# EAGLE design cinamin (EAGLE 6.5.0)
AUTHOR: Joshua Adkins; REV: A; REVISION: A

## Sheet 1 of 4
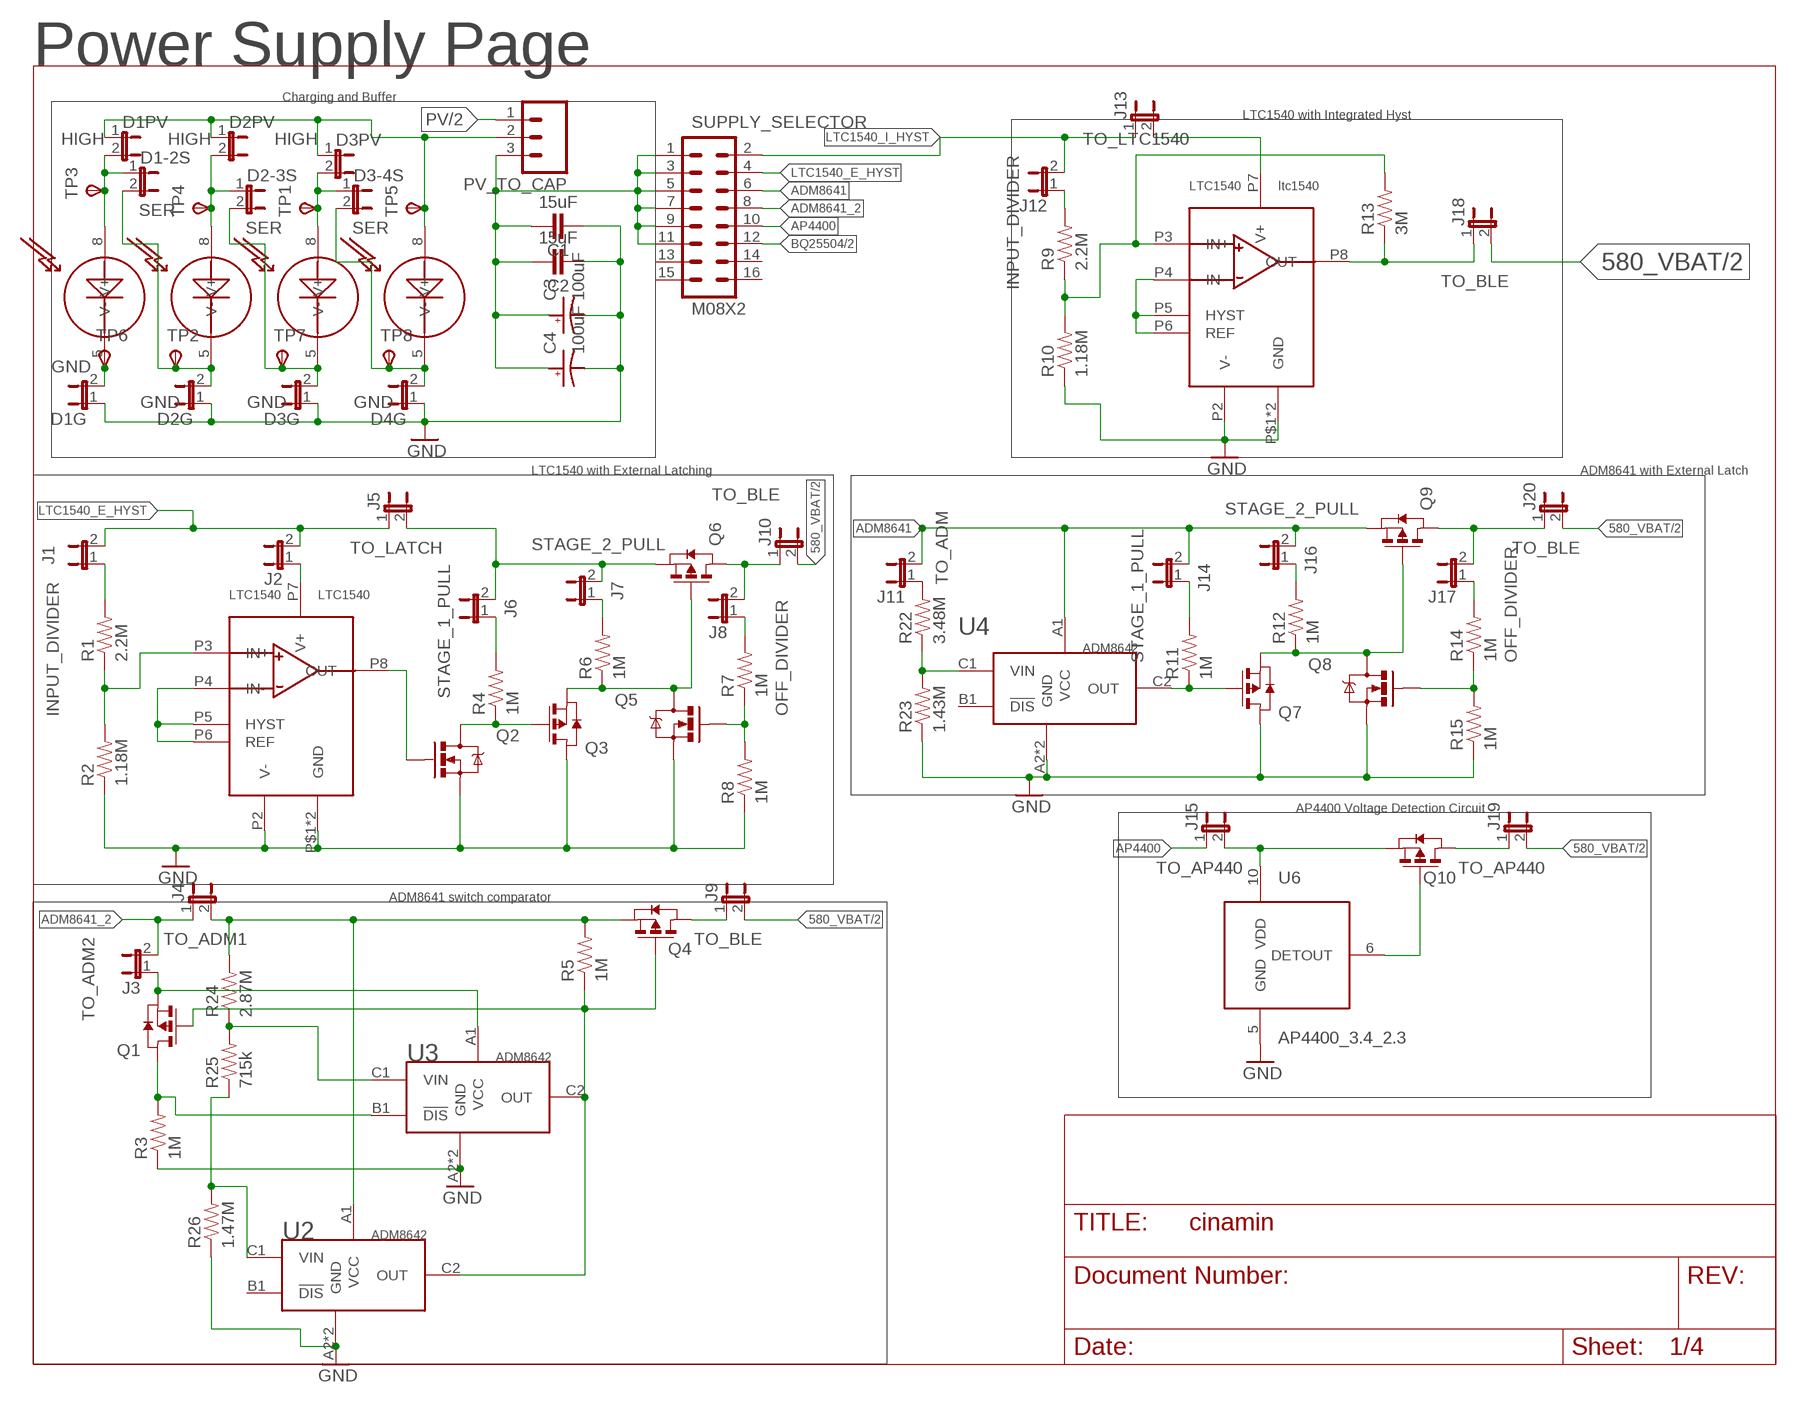
[diagram p0: schematic, sheet 1]

### Parts
C1  15uF  CAPACITOR  [0402_CAP]
C2  15uF  CAPACITOR  [0402_CAP]
C3  100uF  CAP_POL0603  [CAP0603]
C4  100uF  CAP_POL0603  [CAP0603]
D1  CPC1822  [SOIC-8]
D1-2S  SER  JUMPER-2PTH  [1X02]
D1G  GND  JUMPER-2PTH  [1X02]
D1PV  HIGH  JUMPER-2PTH  [1X02]
D2  CPC1822  [SOIC-8]
D2-3S  SER  JUMPER-2PTH  [1X02]
D2G  GND  JUMPER-2PTH  [1X02]
D2PV  HIGH  JUMPER-2PTH  [1X02]
D3  CPC1822  [SOIC-8]
D3-4S  SER  JUMPER-2PTH  [1X02]
D3G  GND  JUMPER-2PTH  [1X02]
D3PV  HIGH  JUMPER-2PTH  [1X02]
D4  CPC1822  [SOIC-8]
D4G  GND  JUMPER-2PTH  [1X02]
J1  INPUT_DIVIDER  JUMPER-2PTH  [1X02]
J2  JUMPER-2PTH  [1X02]
J3  TO_ADM2  JUMPER-2PTH  [1X02]
J4  TO_ADM1  JUMPER-2PTH  [1X02]
J5  TO_LATCH  JUMPER-2PTH  [1X02]
J6  STAGE_1_PULL  JUMPER-2PTH  [1X02]
J7  STAGE_2_PULL  JUMPER-2PTH  [1X02]
J8  OFF_DIVIDER  JUMPER-2PTH  [1X02]
J9  TO_BLE  JUMPER-2PTH  [1X02]
J10  TO_BLE  JUMPER-2PTH  [1X02]
J11  TO_ADM  JUMPER-2PTH  [1X02]
J12  INPUT_DIVIDER  JUMPER-2PTH  [1X02]
J13  TO_LTC1540  JUMPER-2PTH  [1X02]
J14  STAGE_1_PULL  JUMPER-2PTH  [1X02]
J15  TO_AP440  JUMPER-2PTH  [1X02]
J16  STAGE_2_PULL  JUMPER-2PTH  [1X02]
J17  OFF_DIVIDER  JUMPER-2PTH  [1X02]
J18  TO_BLE  JUMPER-2PTH  [1X02]
J19  TO_AP440  JUMPER-2PTH  [1X02]
J20  TO_BLE  JUMPER-2PTH  [1X02]
PV_TO_CAP  M03PTH  [1X03]
Q1  MOSFET-PCHANNEL  [XFDFN-3]
Q2  MOSFET-NCHANNELXFDN-3  [XFDFN-3]
Q3  MOSFET-PCHANNEL  [XFDFN-3]
Q4  MOSFET-PCHANNEL  [XFDFN-3]
Q5  MOSFET-NCHANNELXFDN-3  [XFDFN-3]
Q6  MOSFET-PCHANNEL  [XFDFN-3]
Q7  MOSFET-PCHANNEL  [XFDFN-3]
Q8  MOSFET-NCHANNELXFDN-3  [XFDFN-3]
Q9  MOSFET-PCHANNEL  [XFDFN-3]
Q10  MOSFET-PCHANNEL  [XFDFN-3]
R1  2.2M  RESISTOR0402_RES  [0402_RES]
R2  1.18M  RESISTOR0402_RES  [0402_RES]
R3  1M  RESISTOR0402_RES  [0402_RES]
R4  1M  RESISTOR0402_RES  [0402_RES]
R5  1M  RESISTOR0402_RES  [0402_RES]
R6  1M  RESISTOR0402_RES  [0402_RES]
R7  1M  RESISTOR0402_RES  [0402_RES]
R8  1M  RESISTOR0402_RES  [0402_RES]
R9  2.2M  RESISTOR0402_RES  [0402_RES]
R10  1.18M  RESISTOR0402_RES  [0402_RES]
R11  1M  RESISTOR0402_RES  [0402_RES]
R12  1M  RESISTOR0402_RES  [0402_RES]
R13  3M  RESISTOR0402_RES  [0402_RES]
R14  1M  RESISTOR0402_RES  [0402_RES]
R15  1M  RESISTOR0402_RES  [0402_RES]
R22  3.48M  RESISTOR0402_RES  [0402_RES]
R23  1.43M  RESISTOR0402_RES  [0402_RES]
R24  2.87M  RESISTOR0402_RES  [0402_RES]
R25  715k  RESISTOR0402_RES  [0402_RES]
R26  1.47M  RESISTOR0402_RES  [0402_RES]
SUPPLY_SELECTOR  M08X2  [2X8]
TP1  TPSPAD1-13  [P1-13]
TP2  TPSPAD1-13  [P1-13]
TP3  TPSPAD1-13  [P1-13]
TP4  TPSPAD1-13  [P1-13]
TP5  TPSPAD1-13  [P1-13]
TP6  TPSPAD1-13  [P1-13]
TP7  TPSPAD1-13  [P1-13]
TP8  TPSPAD1-13  [P1-13]
U1  LTC1540  [DFN-8]
U2  ADM8642  [WLCSP-6]
U3  ADM8642  [WLCSP-6]
U4  ADM8642  [WLCSP-6]
U5  ltc1540  LTC1540  [DFN-8]
U6  AP4400_3.4_2.3  AP4400  [TSOP-10]

### Nets
580_VBAT: J9.2 J10.2 J18.2 J19.2 J20.2 ; also sheet 2,3
ADM8641: J11.2 J14.2 J16.2 Q9.S SUPPLY_SELECTOR.6 U4.A1(VCC)
ADM8641_2: J3.2 J4.1 SUPPLY_SELECTOR.8
AP4400: J15.1 SUPPLY_SELECTOR.10
BQ25504: SUPPLY_SELECTOR.12 ; also sheet 2
GND: C1.2 C2.2 C3.NEG(ANODE) C4.NEG(ANODE) D1G.1 D2G.1 D3G.1 D4G.1 Q2.S Q3.D Q5.S Q7.D Q8.S R2.1 R3.1 R8.1 R10.1 R15.1 R23.1 R26.1 U1.P1(GND) U1.P2(V-) U1.P$1(GND) U2.A2(GND) U2.B2(GND) U3.A2(GND) U3.B2(GND) U4.A2(GND) U4.B2(GND) U5.P1(GND) U5.P2(V-) U5.P$1(GND) U6.5(GND) ; also sheet 2,3,4
HIGH: J19.1 Q10.D
LTC1540_E_HYST: J1.2 J2.2 J5.1 SUPPLY_SELECTOR.4
LTC1540_I_HYST: J12.2 J13.1 SUPPLY_SELECTOR.2
N$1: C1.1 C2.1 C3.POS(CATHODE) C4.POS(CATHODE) PV_TO_CAP.3 SUPPLY_SELECTOR.1 SUPPLY_SELECTOR.3 SUPPLY_SELECTOR.5 SUPPLY_SELECTOR.7 SUPPLY_SELECTOR.9 SUPPLY_SELECTOR.11
N$2: U1.P4(IN-) U1.P5(HYST) U1.P6(REF)
N$3: R9.1 R10.2 R13.2 U5.P3(IN+)
N$4: U5.P4(IN-) U5.P5(HYST) U5.P6(REF)
N$9: Q2.G U1.P8(OUT)
N$13: J11.1 R22.2
N$14: R1.1 R2.2 U1.P3(IN+)
N$15: Q2.D Q3.G R4.1
N$18: J1.1 R1.2
N$19: Q3.S Q5.D Q6.G R6.1
N$20: J2.1 U1.P7(V+)
N$21: J6.1 R4.2
N$22: J7.1 R6.2
N$23: Q5.G R7.1 R8.2
N$24: J8.2 J10.1 Q6.D
N$25: J5.2 J6.2 J7.2 Q6.S
N$26: J8.1 R7.2
N$27: J12.1 R9.2
N$28: J13.2 U5.P7(V+)
N$29: Q7.G R11.1 U4.C2(OUT)
N$30: Q7.S Q8.D Q9.G R12.1
N$31: Q8.G R14.1 R15.2
N$32: J17.2 J20.1 Q9.D
N$33: J14.1 R11.2
N$34: J16.1 R12.2
N$35: R24.1 R25.2 U3.C1(VIN)
N$36: J17.1 R14.2
N$37: Q10.G U6.6(DETOUT)
N$38: J9.1 Q4.D
N$39: Q1.D R3.2 U3.B1(!DIS)
N$40: J3.1 Q1.S U3.A1(VCC)
N$41: Q1.G Q4.G R5.1 U2.C2(OUT) U3.C2(OUT)
N$42: J4.2 Q4.S R5.2 R24.2 U2.A1(VCC)
N$43: D3-4S.2 D4.5(V-) D4G.2 TP8.TP(PP)
N$59: R22.1 R23.2 U4.C1(VIN)
N$60: R25.1 R26.2 U2.C1(VIN)
N$61: D1.5(V-) D1G.2 TP6.TP(PP)
N$62: D1-2S.2 D2.5(V-) D2G.2 TP2.TP(PP)
N$63: D2-3S.2 D3.5(V-) D3G.2 TP7.TP(PP)
N$65: D1-2S.1 D1.8(V+) D1PV.2 TP3.TP(PP)
N$66: D1PV.1 D2PV.1 D3PV.1 D4.8(V+) PV_TO_CAP.2 TP5.TP(PP)
N$67: D2-3S.1 D2.8(V+) D2PV.2 TP4.TP(PP)
N$68: D3-4S.1 D3.8(V+) D3PV.2 TP1.TP(PP)
OUT: J18.1 R13.1 U5.P8(OUT)
PV: PV_TO_CAP.1 ; also sheet 2
VDD: J15.2 Q10.S U6.10(VDD)
Unconnected: SUPPLY_SELECTOR.13 SUPPLY_SELECTOR.14 SUPPLY_SELECTOR.15 SUPPLY_SELECTOR.16 U2.B1(!DIS) U4.B1(!DIS)

### Notes on the sheet
- Power Supply Page
- Charging and Buffer
- LTC1540 with Integrated Hyst
- LTC1540 with External Latching | ADM8641 with External Latch
- AP4400 Voltage Detection Circuit
- ADM8641 switch comparator

## Sheet 2 of 4
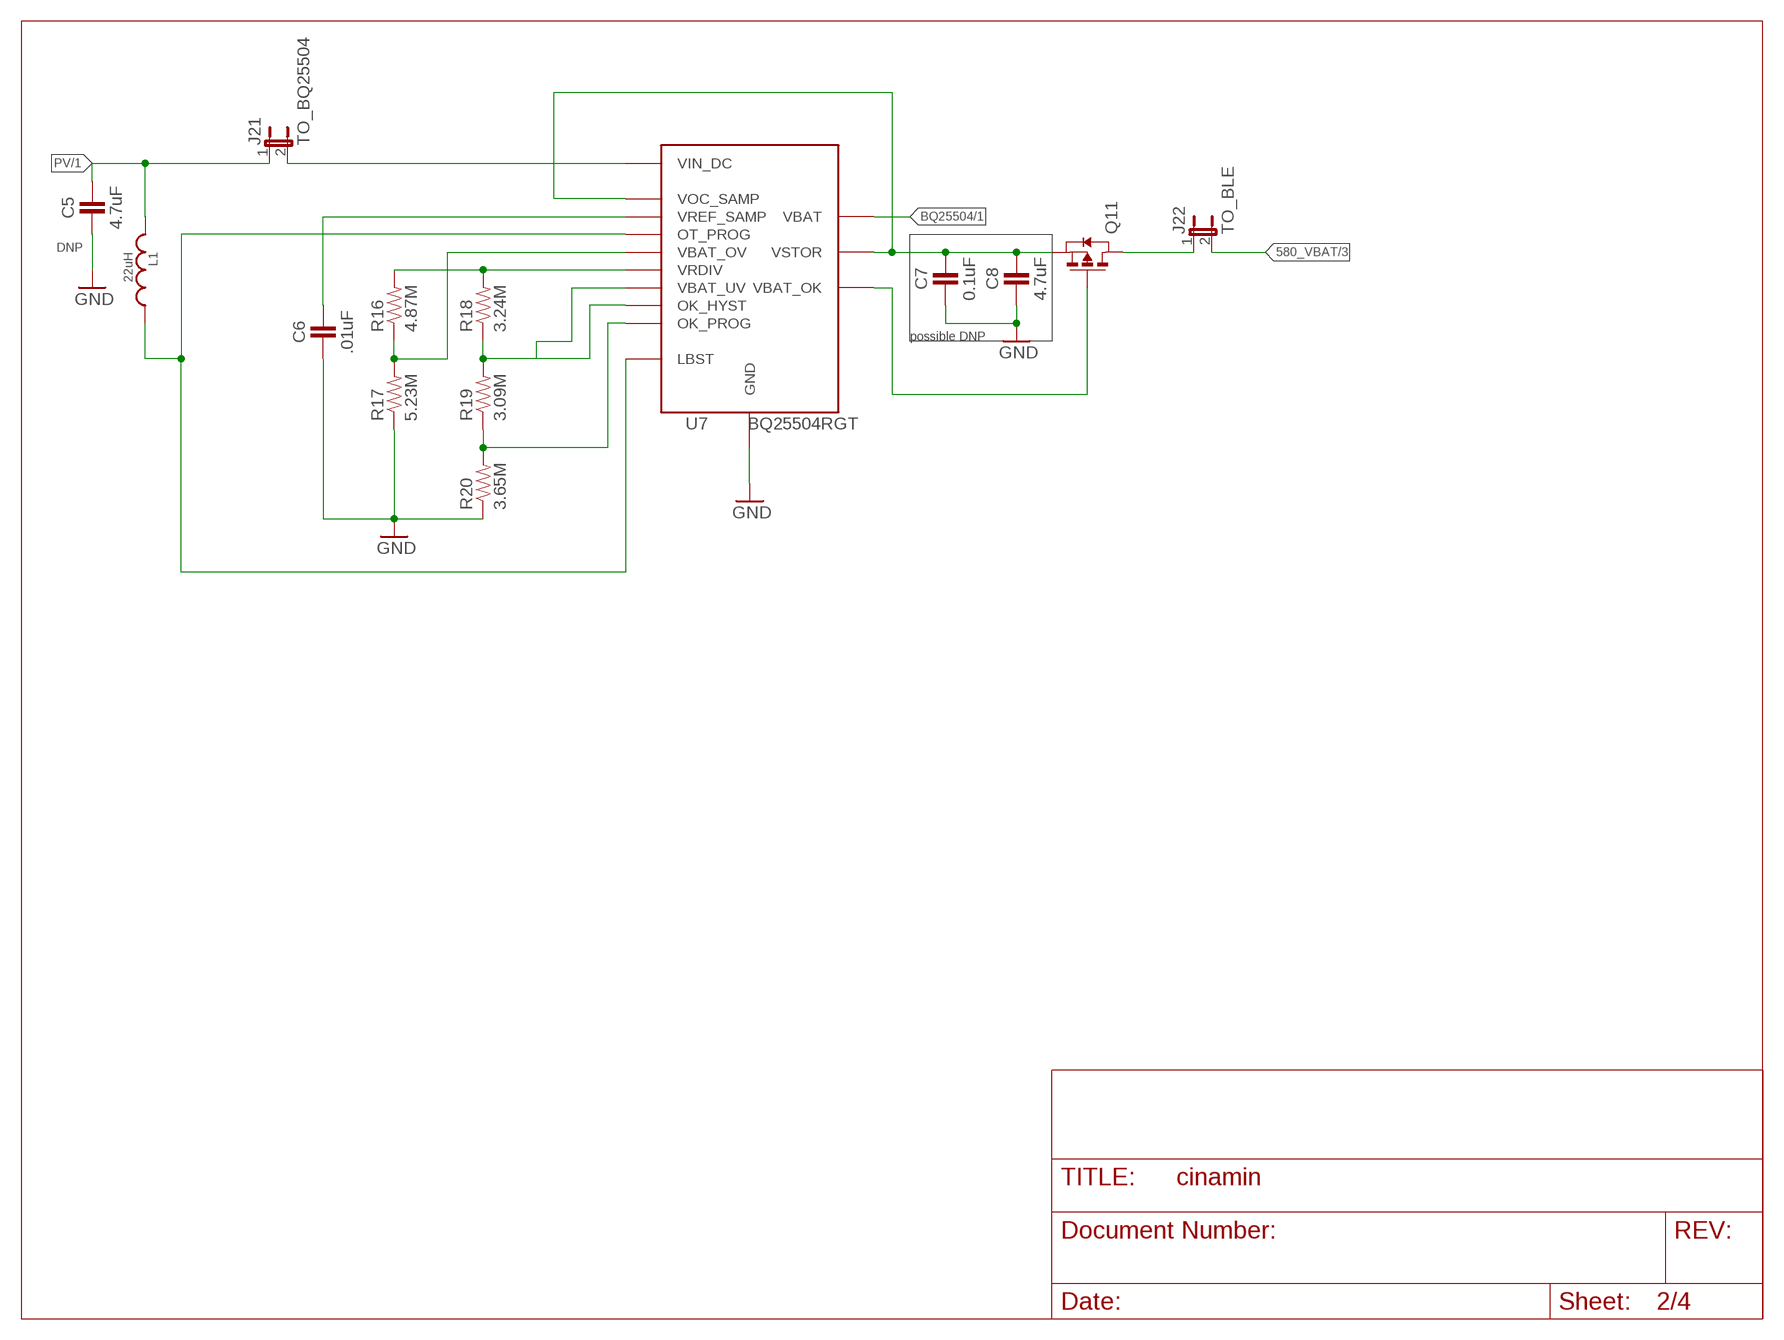
[diagram p1: schematic, sheet 2]

### Parts
C5  4.7uF  CAPACITOR  [0402_CAP]
C6  .01uF  CAPACITOR  [0402_CAP]
C7  0.1uF  CAPACITOR  [0402_CAP]
C8  4.7uF  CAPACITOR  [0402_CAP]
J21  TO_BQ25504  JUMPER-2PTH  [1X02]
J22  TO_BLE  JUMPER-2PTH  [1X02]
L1  22uH  INDUCTOR0603  [0603_CAP]
Q11  MOSFET-PCHANNEL  [XFDFN-3]
R16  4.87M  RESISTOR0402_RES  [0402_RES]
R17  5.23M  RESISTOR0402_RES  [0402_RES]
R18  3.24M  RESISTOR0402_RES  [0402_RES]
R19  3.09M  RESISTOR0402_RES  [0402_RES]
R20  3.65M  RESISTOR0402_RES  [0402_RES]
U7  BQ25504RGT  [S-PVQFN-N16]

### Nets
580_VBAT: J22.2 ; also sheet 1,3
BQ25504: U7.14(VBAT) ; also sheet 1
GND: C5.2 C6.2 C7.2 C8.2 R17.1 R20.1 U7.1(GND) U7.12(GND) U7.13(GND) ; also sheet 1,3,4
N$44: L1.1 U7.5(OT_PROG) U7.16(LBST)
N$45: U7.8(VBAT_UV)
N$46: R16.2 R18.2 U7.7(VRDIV)
N$47: Q11.G U7.11(VBAT_OK)
N$49: R18.1 R19.2 U7.9(OK_HYST)
N$50: R19.1 R20.2 U7.10(OK_PROG)
N$51: C6.1 U7.4(VREF_SAMP)
N$54: R16.1 R17.2 U7.6(VBAT_OV)
OUT2: J22.1 Q11.D
PV: C5.1 J21.1 L1.2 ; also sheet 1
VIN_DC: J21.2 U7.2(VIN_DC)
VSTOR: C7.1 C8.1 Q11.S U7.3(VOC_SAMP) U7.15(VSTOR)

### Notes on the sheet
- DNP
- possible DNP

## Sheet 3 of 4
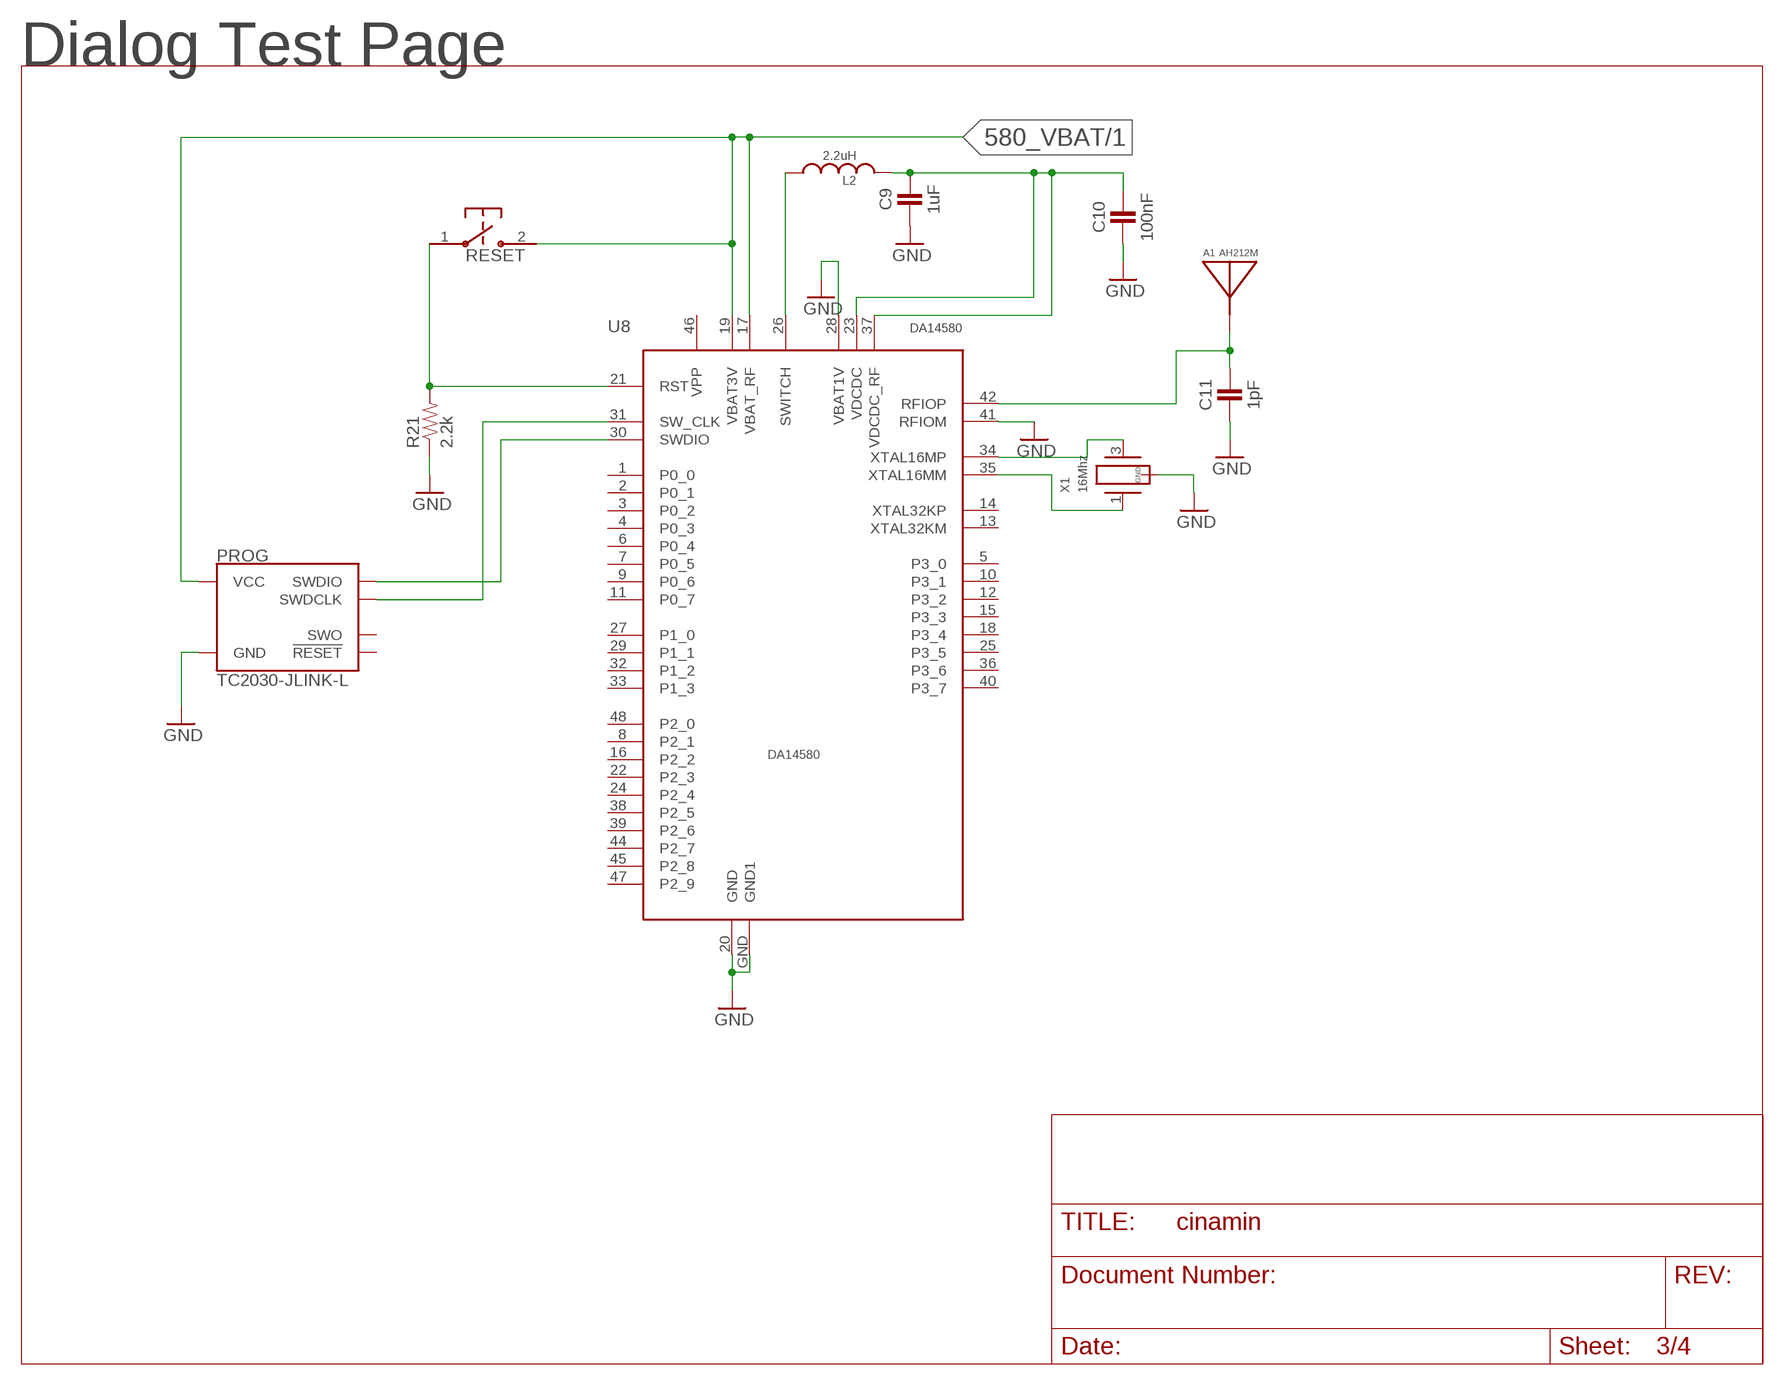
[diagram p2: schematic, sheet 3]

### Parts
A1  AH212M  [AH212M]
C9  1uF  CAPACITOR  [0402_CAP]
C10  100nF  CAPACITOR  [0402_CAP]
C11  1pF  CAPACITOR  [0402_CAP]
L2  2.2uH  INDUCTOR0402  [0402_CAP]
PROG  TC2030-JLINK-L  [TC2030-IDC]
R21  2.2k  RESISTOR0402_RES  [0402_RES]
RESET  B3U-1000P  [B3U-1000P]
U8  DA14580  DA14580-48  [QFN-48-6MM]
X1  16Mhz  TXC-8Y  [TXC-8Y]

### Nets
580_VBAT: PROG.1(VCC) RESET.2 U8.17(VBAT_RF) U8.19(VBAT3V) ; also sheet 1,2
GND: C9.2 C10.2 C11.2 PROG.5(GND) R21.1 U8.20(GND) U8.28(VBAT1V) U8.41(RFIOM) U8.GND(GND1) X1.2(GND) X1.4(GND) ; also sheet 1,2,4
N$5: A1.P1(ANTENNA) C11.1 U8.42(RFIOP)
N$7: L2.1 U8.26(SWITCH)
N$8: C9.1 C10.1 L2.2 U8.23(VDCDC) U8.37(VDCDC_RF)
N$10: U8.34(XTAL16MP) X1.3
N$11: U8.35(XTAL16MM) X1.1
N$52: PROG.2(SWDIO) U8.30(SWDIO)
N$53: PROG.4(SWDCLK) U8.31(SW_CLK)
N$56: R21.2 RESET.1 U8.21(RST)
Unconnected: PROG.3(!RESET) PROG.6(SWO) U8.1(P0_0) U8.2(P0_1) U8.3(P0_2) U8.4(P0_3) U8.5(P3_0) U8.6(P0_4) U8.7(P0_5) U8.8(P2_1) U8.9(P0_6) U8.10(P3_1) U8.11(P0_7) U8.12(P3_2) U8.13(XTAL32KM) U8.14(XTAL32KP) U8.15(P3_3) U8.16(P2_2) U8.18(P3_4) U8.22(P2_3) U8.24(P2_4) U8.25(P3_5) U8.27(P1_0) U8.29(P1_1) U8.32(P1_2) U8.33(P1_3) U8.36(P3_6) U8.38(P2_5) U8.39(P2_6) U8.40(P3_7) U8.44(P2_7) U8.45(P2_8) U8.46(VPP) U8.47(P2_9) U8.48(P2_0)

### Notes on the sheet
- Dialog Test Page

## Sheet 4 of 4
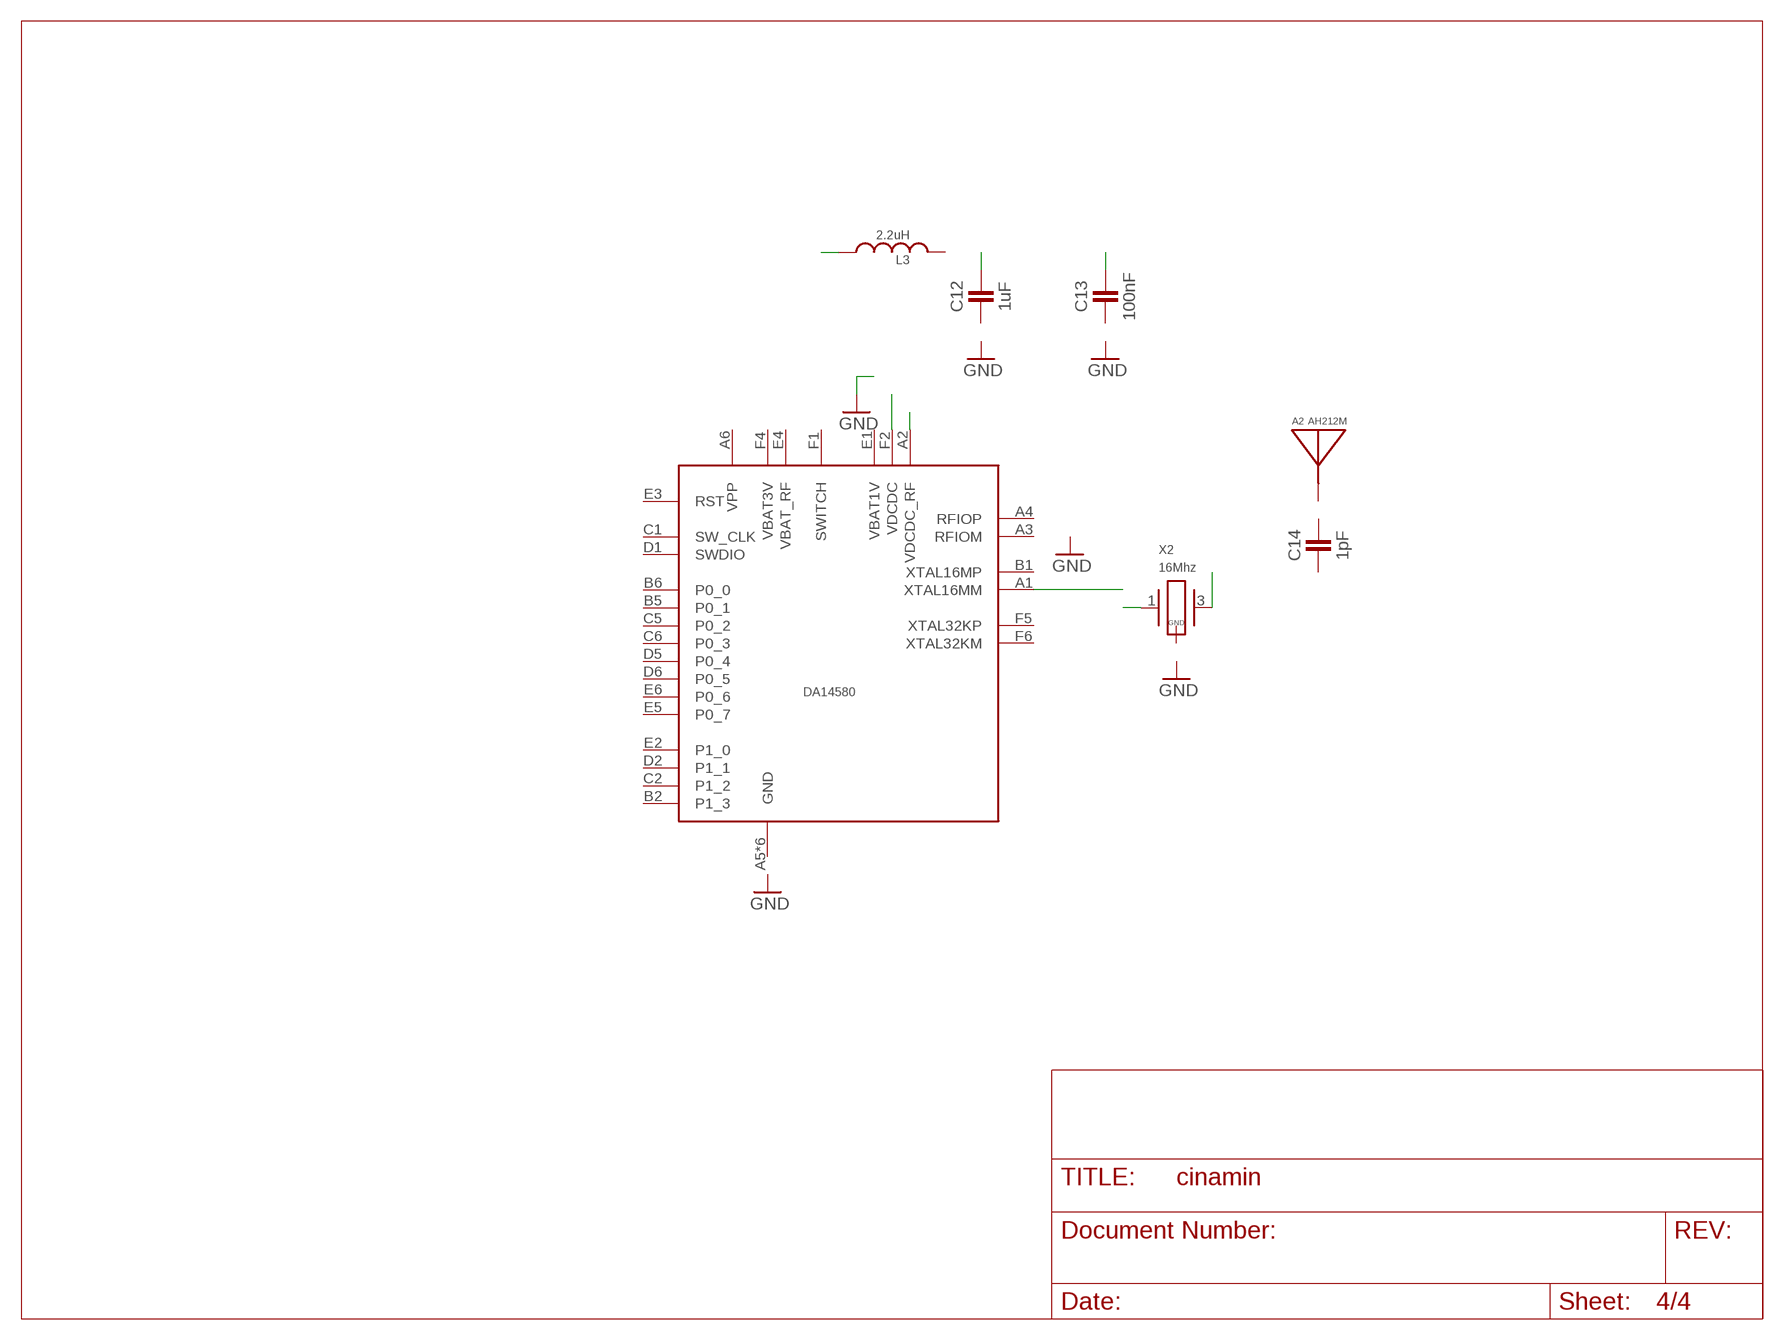
[diagram p3: schematic, sheet 4]

### Parts
A2  AH212M  AF212M  [AH212M@1]
C12  1uF  CAPACITOR01005_CAP  [01005_CAP]
C13  100nF  CAPACITOR01005_CAP  [01005_CAP]
C14  1pF  CAPACITOR0201_CAP  [0201_CAP]
L3  2.2uH  INDUCTOR0402  [0402_CAP]
U9  DA14580-BGA  [WLCSP34]
X2  16Mhz  TXC-8Y  [TXC-8Y]

### Nets
N$6: U9.A2(VDCDC_RF)
N$12: L3.1
N$16: X2.3
N$17: U9.A1(XTAL16MM)
N$48: X2.1
N$55: U9.F2(VDCDC)
N$57: C12.P$1
N$58: C13.P$1
Unconnected: A2.P1(ANTENNA) C12.P$2 C13.P$2 C14.P$1 C14.P$2 L3.2 U9.A3(RFIOM) U9.A4(RFIOP) U9.A5(GND) U9.A6(VPP) U9.B1(XTAL16MP) U9.B2(P1_3) U9.B4(GND) U9.B5(P0_1) U9.B6(P0_0) U9.C1(SW_CLK) U9.C2(P1_2) U9.C3(GND) U9.C5(P0_2) U9.C6(P0_3) U9.D1(SWDIO) U9.D2(P1_1) U9.D3(GND) U9.D4(GND) U9.D5(P0_4) U9.D6(P0_5) U9.E1(VBAT1V) U9.E2(P1_0) U9.E3(RST) U9.E4(VBAT_RF) U9.E5(P0_7) U9.E6(P0_6) U9.F1(SWITCH) U9.F3(GND) U9.F4(VBAT3V) U9.F5(XTAL32KP) U9.F6(XTAL32KM) X2.2(GND) X2.4(GND)

## Library data of the parts
A1 = chips:AH212M: Small 2.4Ghz chip antenna; DIGIKEY: 587-2725-1-ND
A2 = chips:AF212M
C1 C2 C5-C14 = passives:CAPACITOR: 0402 Capacitor
C3 C4 = passives:CAP_POL
D1-D4 = chips:CPC1822: SOIC Solar Cell; DIGIKEY: CLA289-ND
D1-2S D1G D1PV D2-3S D2G D2PV D3-4S D3G D3PV D4G J1-J22 = SparkFun-Passives:JUMPER-2: Jumper Basic 0.1" spaced jumper. Use with breakaway headers.
L1-L3 = passives:INDUCTOR
PROG = connector:TC2030-JLINK
PV_TO_CAP = SparkFun-Connectors:M03: Header 3 Standard 3-pin 0.1" header. Use with straight break away headers (SKU : PRT-00116), right angle break away headers (PRT-00553), swiss pins (PRT-00743), machine pins (PRT-00117), and female headers (PRT-00115). Molex polarized connector foot print use with SKU : PRT-08232 with associated crimp pins and housings.
Q1 Q3 Q4 Q6 Q7 Q9-Q11 = fets:MOSFET-PCHANNEL: small package Pchannel fet; DIGIKEY: DMP21D5UFB4-7BDICT-ND
Q2 Q5 Q8 = fets:MOSFET-NCHANNEL: Generic NMOS footprint; DIGIKEY: DMN2400UFB4-7DICT-ND
R1-R26 = passives:RESISTOR: Resistor Basic schematic elements and footprints for 0603, 1206, and PTH resistors.
RESET = switches:B3U: Switch; DIGIKEY: SW1020CT-ND
SUPPLY_SELECTOR = SparkFun-Connectors:M08X2: .1" headers, two rows of 8 each
TP1-TP8 = testpad:TPS: TEST PIN
U1 U5 = chips:LTC1540: LTC Nanopower Comparator with Bandgap reference; DIGIKEY: LTC1540CDD#PBF-ND
U2-U4 = chips:ADM8642: analog devices comparator with separate supply; DIGIKEY: ADM8642T100ACBZ-R7CT-ND
U6 = chips:AP4400: Ultra Low Power Voltage Detector with Hysterisis; DIGIKEY: CANT_BUY
U7 = chips:BQ25504: TI BQ25504 Ultra Low Power Boost Converter with Battery Management for Energy Harvester Applications; DIGIKEY: 296-29741-1-ND
U8 = chips:DA14580-48: Dialog Semiconductor BLE chip; DIGIKEY: 1564-1014-1-ND
U9 = chips:DA14580-BGA: WLCSP package of low power BLE chip; DIGIKEY: 1564-1012-1-ND
X1 X2 = crystals:TXC-8Y: 2mmx1.6mm SMD Crystal

## Board
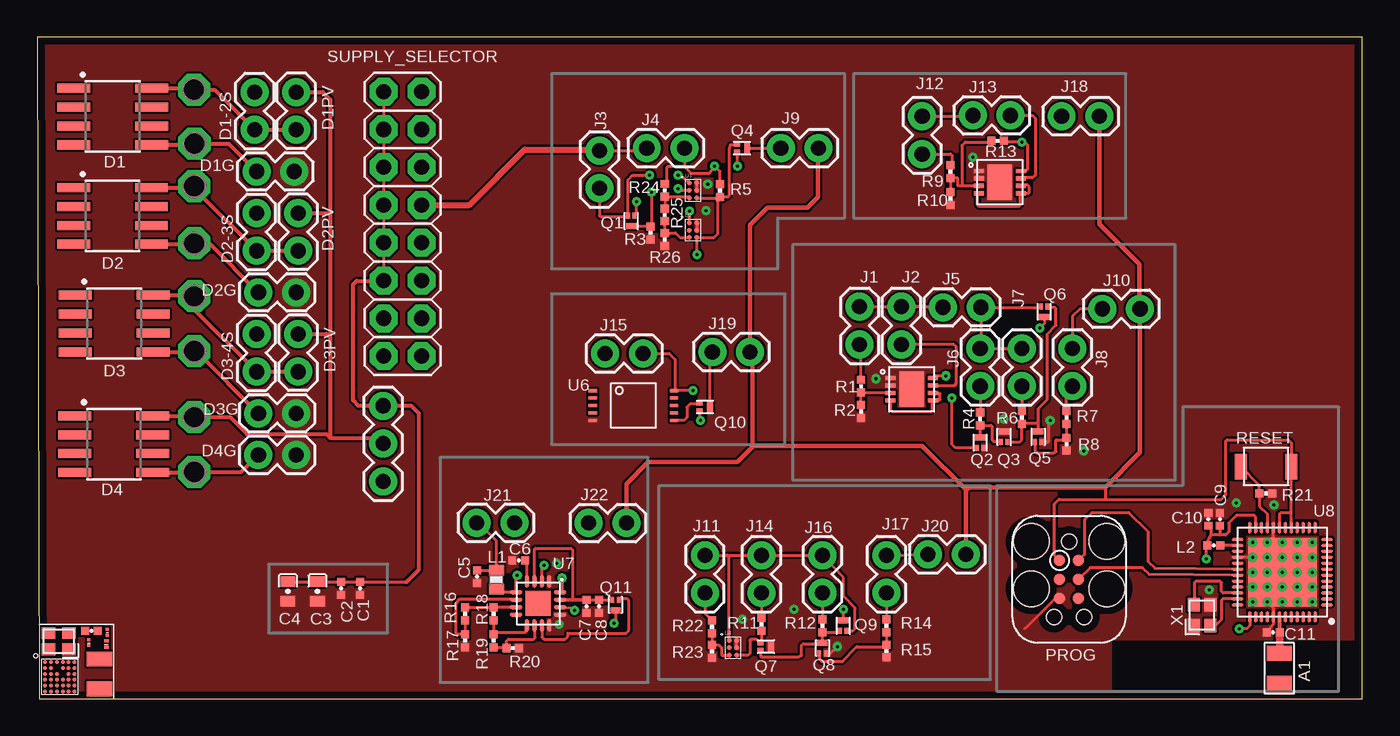
[diagram p4: board, top side]
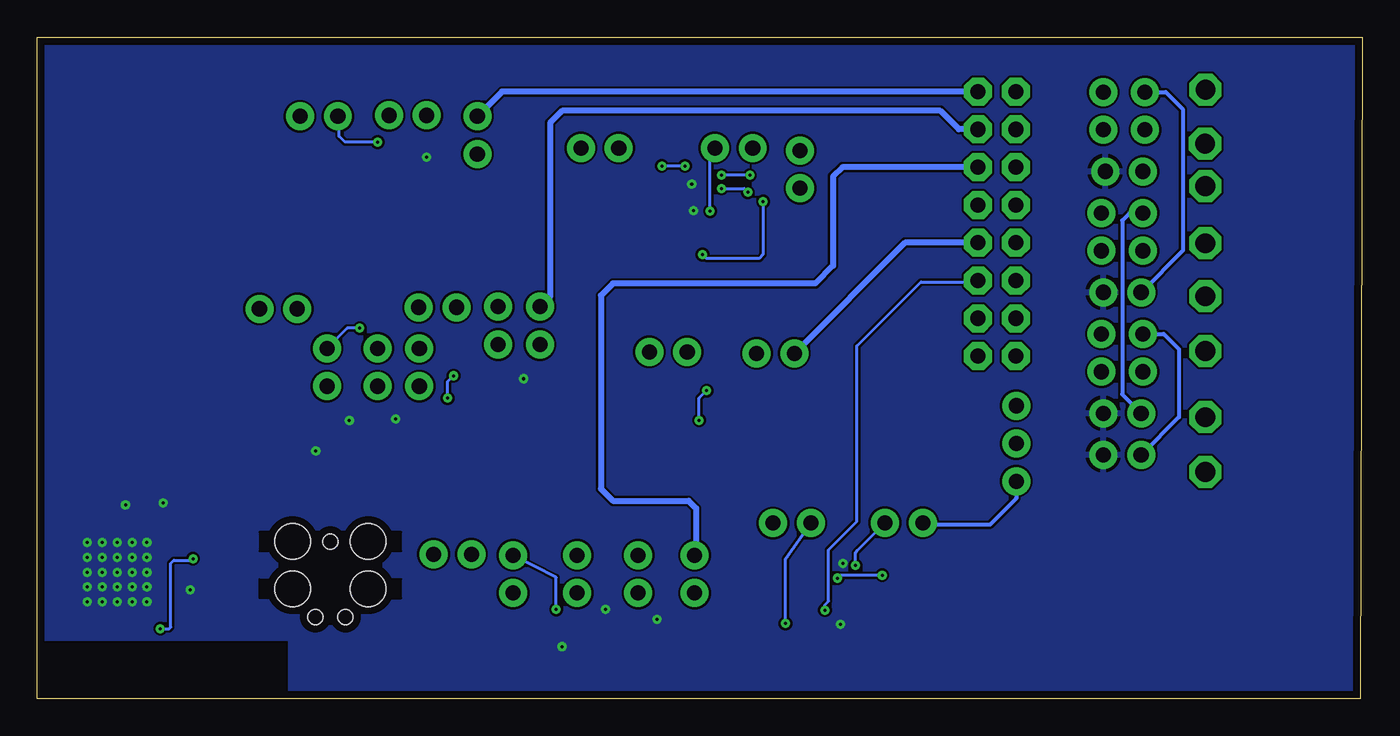
[diagram p5: board, bottom side, seen from below]

Size 89.02 x 44.45 mm. Coordinates in mm from the lower left corner, seen from the top.
Outline: 0.13,0 89.02,0 89.02,44.45 0,44.45 0.13,0
Copper layers (1*16): Top 0.0178mm / dielectric 59mil / Bottom 0.0178mm
Design rules "sunstone-2lyr_v1.0.0.3 *": minimum track width 6mil, minimum drill 14mil, track to track 6mil, track to pad 6mil, pad to pad 6mil, via to via 6mil, smd to smd 6mil, copper to edge 20mil, drill to drill 16mil, minimum pad ring 8mil, minimum via ring 8mil, stop-mask expansion 3mil, vias tented up to drill 15mil, thermal gap 10mil

### Footprints (pad centres in the part's own frame; a part is rotated, then mirrored left to right if it is on the bottom)
AH212M = smd 1.7 x 1: P1 0,0; P2 0,2
AH212M@1 = smd 1.7 x 1: P1 0,0; P2 0,2
0402_CAP = smd 0.536 x 0.546: 1 -0.433,0; 2 0.433,0
CAP0603 = smd 0.7 x 1: NEG 0.65,0; POS -0.65,0
01005_CAP = smd 0.22 x 0.2: P$1 0,0.19; P$2 0,-0.19
0201_CAP = smd 0.3 x 0.21: P$1 0,0.22; P$2 0,-0.22
SOIC-8 = smd 0.61 x 2.21: 1 -1.905,-2.616; 2 -0.635,-2.616; 3 0.635,-2.616; 4 1.905,-2.616; 5 1.905,2.616; 6 0.635,2.616; 7 -0.635,2.616; 8 -1.905,2.616
1X02 = drill 1.016 pad 1.88: 1 0,0; 2 2.54,0
0603_CAP = smd 0.7 x 1: 1 -0.65,0; 2 0.65,0
TC2030-IDC = smd 0.787 x 0.787: 1 -1.27,-0.635; 2 -1.27,0.635; 3 0,-0.635; 4 0,0.635; 5 1.27,-0.635; 6 1.27,0.635 | hole 2.375: -2.54,2.54; 0.635,2.54; 0.635,-2.54; -2.54,-2.54 | hole 1.016: -2.54,0; 2.54,1.016; 2.54,-1.016
1X03 = drill 1.016 pad 1.88: 1 0,0; 2 2.54,0; 3 5.08,0
XFDFN-3 = smd 0.4 x 0.7: D 0.35,0 | smd 0.4 x 0.25: G -0.35,0.215; S -0.35,-0.215
0402_RES = smd 0.536 x 0.546: 1 -0.433,0; 2 0.433,0
B3U-1000P = smd 0.8 x 1.7: 1 -1.7,0; 2 1.7,0
2X8 = drill 1.016 pad 1.88 octagon: 1 0,0; 2 0,2.54; 3 2.54,0; 4 2.54,2.54; 5 5.08,0; 6 5.08,2.54; 7 7.62,0; 8 7.62,2.54; 9 10.16,0; 10 10.16,2.54; 11 12.7,0; 12 12.7,2.54; 13 15.24,0; 14 15.24,2.54; 15 17.78,0; 16 17.78,2.54
P1-13 = drill 1.321 pad 2.159 octagon: TP 0,0
DFN-8 = smd 0.28 x 0.675: P1 0.75,0.08; P2 1.25,0.08; P3 1.75,0.08; P4 2.25,0.08; P5 2.25,2.92; P6 1.75,2.92; P7 1.25,2.92; P8 0.75,2.92 | smd 2.38 x 1.65: P$1 1.5,1.5
WLCSP-6 = smd 0.32 x 0.32: A1 0,1; A2 0.5,1; B1 0,0.5; B2 0.5,0.5; C1 0,0; C2 0.5,0
TSOP-10 = smd 0.22 x 0.55: 1 -1,-2.73; 2 -0.5,-2.73; 3 0,-2.73; 4 0.5,-2.73; 5 1,-2.73; 6 1,2.73; 7 0.5,2.73; 8 0,2.73; 9 -0.5,2.73; 10 -1,2.73
S-PVQFN-N16 = smd 0.85 x 0.28: 1 -1.475,0.75; 2 -1.475,0.25; 3 -1.475,-0.25; 4 -1.475,-0.75; 9 1.475,-0.75; 10 1.475,-0.25; 11 1.475,0.25; 12 1.475,0.75 | smd 0.28 x 0.85: 5 -0.75,-1.475; 6 -0.25,-1.475; 7 0.25,-1.475; 8 0.75,-1.475; 13 0.75,1.475; 14 0.25,1.475; 15 -0.25,1.475; 16 -0.75,1.475 | smd 1.7 x 1.7: THERMALPAD 0,0
QFN-48-6MM = smd 0.8 x 0.203: 1 -3,2.2; 2 -3,1.8; 3 -3,1.4; 4 -3,1; 5 -3,0.6; 6 -3,0.2; 7 -3,-0.2; 8 -3,-0.6; 9 -3,-1; 10 -3,-1.4; 11 -3,-1.8; 12 -3,-2.2; 25 3,-2.2; 26 3,-1.8; 27 3,-1.4; 28 3,-1; 29 3,-0.6; 30 3,-0.2; 31 3,0.2; 32 3,0.6; 33 3,1; 34 3,1.4; 35 3,1.8; 36 3,2.2 | smd 0.203 x 0.8: 13 -2.2,-3; 14 -1.8,-3; 15 -1.4,-3; 16 -1,-3; 17 -0.6,-3; 18 -0.2,-3; 19 0.2,-3; 20 0.6,-3; 21 1,-3; 22 1.4,-3; 23 1.8,-3; 24 2.2,-3; 37 2.2,3; 38 1.8,3; 39 1.4,3; 40 1,3; 41 0.6,3; 42 0.2,3; 43 -0.2,3; 44 -0.6,3; 45 -1,3; 46 -1.4,3; 47 -1.8,3; 48 -2.2,3 | smd 4.6 x 4.6: GND 0,0
WLCSP34 = smd 0.27 x 0.27: A1 0,2; A2 0.4,2; A3 0.8,2; A4 1.2,2; A5 1.6,2; A6 2,2; B1 0,1.6; B2 0.4,1.6; B4 1.2,1.6; B5 1.6,1.6; B6 2,1.6; C1 0,1.2; C2 0.4,1.2; C3 0.8,1.2; C5 1.6,1.2; C6 2,1.2; D1 0,0.8; D2 0.4,0.8; D3 0.8,0.8; D4 1.2,0.8; D5 1.6,0.8; D6 2,0.8; E1 0,0.4; E2 0.4,0.4; E3 0.8,0.4; E4 1.2,0.4; E5 1.6,0.4; E6 2,0.4; F1 0,0; F2 0.4,0; F3 0.8,0; F4 1.2,0; F5 1.6,0; F6 2,0
TXC-8Y = smd 0.9 x 0.8: 1 -0.7,-0.55; 2 0.7,-0.55; 3 0.7,0.55; 4 -0.7,0.55

### Placement (x,y rotation side)
A1  83.45,3.05 180 top
A2  4.19,0.66 0 top
C1  21.7,7.42 270 top
C2  20.41,7.42 270 top
C3  18.83,7.22 270 top
C4  16.84,7.22 270 top
C5  29.55,8.2 270 top
C6  32.35,9.3 180 top
C7  36.9,6.2 270 top
C8  37.75,6.2 270 top
C9  79.46,12.06 90 top
C10  78.67,12.06 90 top
C11  83.03,4.46 180 top
C12  3.47,3.76 0 top
C13  4.71,4.46 0 top
C14  4.65,3.66 0 top
D1  5.07,39.12 270 top
D1-2S  14.61,38.23 90 top
D1G  17.27,35.43 180 top
D1PV  17.4,40.77 270 top
D2  5.06,32.44 270 top
D2-3S  14.73,30.1 90 top
D2G  17.4,27.3 180 top
D2PV  17.53,32.64 270 top
D3  5.17,25.21 270 top
D3-4S  14.73,21.97 90 top
D3G  17.4,19.18 180 top
D3PV  17.53,24.51 270 top
D4  5.15,17.1 270 top
D4G  17.4,16.38 180 top
J1  55.25,23.8 90 top
J2  58.05,23.8 90 top
J3  37.77,34.3 90 top
J4  40.95,37 0 top
J5  60.85,26.3 0 top
J6  63.35,21 90 top
J7  66.15,21 90 top
J8  69.55,21 90 top
J9  49.95,37 0 top
J10  71.55,26.2 0 top
J11  44.85,7.1 90 top
J12  59.45,36.6 90 top
J13  62.85,39.2 0 top
J14  48.65,7.1 90 top
J15  38.15,23.2 0 top
J16  52.75,7.1 90 top
J17  57.05,7.1 90 top
J18  68.82,39.14 0 top
J19  45.35,23.3 0 top
J20  59.85,9.7 0 top
J21  29.53,11.82 0 top
J22  37.05,11.8 0 top
L1  30.85,8 90 top
L2  79.04,10.3 180 top
L3  3.65,4.55 180 top
PROG  69.32,8.02 270 top
PV_TO_CAP  23.24,14.61 90 top
Q1  39.9,32.1 270 top
Q2  63.35,17.2 90 top
Q3  64.95,17.6 90 top
Q4  47.35,37 0 top
Q5  67.25,17.6 90 top
Q6  67.65,26 270 top
Q7  48.95,3.5 0 top
Q8  52.75,3.4 90 top
Q9  54.15,4.9 90 top
Q10  44.85,19.6 0 top
Q11  38.85,6.3 270 top
R1  55.35,21 90 top
R2  55.35,19.3 90 top
R3  41.2,31.3 90 top
R4  63.35,18.8 90 top
R5  45.88,34.15 90 top
R6  66.15,18.9 90 top
R7  69.15,18.9 90 top
R8  69.15,17.1 90 top
R9  61.34,35.41 90 top
R10  61.35,33.61 90 top
R11  48.65,5 90 top
R12  52.75,4.9 90 top
R13  64.52,37.49 180 top
R14  57.05,4.9 90 top
R15  57.05,3.2 90 top
R16  28.75,5.7 90 top
R17  28.75,3.9 90 top
R18  30.65,5.7 90 top
R19  30.65,3.9 90 top
R20  31.95,3.4 180 top
R21  82.55,13.8 180 top
R22  45.34,4.83 90 top
R23  45.34,3.17 90 top
R24  42.16,34.16 90 top
R25  42.16,32.51 90 top
R26  42.16,30.86 90 top
RESET  82.55,15.6 0 top
SUPPLY_SELECTOR  23.28,40.8 270 top
TP1  10.54,27.05 90 top
TP2  10.54,30.61 90 top
TP3  10.54,40.92 90 top
TP4  10.54,34.45 90 top
TP5  10.54,18.92 90 top
TP6  10.57,37.3 90 top
TP7  10.54,23.37 90 top
TP8  10.54,15.24 90 top
U1  57.25,22.3 270 top
U2  43.82,30.99 0 top
U3  43.82,33.66 0 top
U4  46.48,2.92 0 top
U5  63.17,36.21 270 top
U6  40.05,19.7 270 top
U7  33.65,6.4 270 top
U8  83.65,8.5 180 top
U9  0.52,0.47 0 top
X1  78.25,5.61 90 top
X2  1.45,3.86 180 top

### Tracks (layer width: path | path; a pad name or v marks a point on that pad's centre or on a via)
580_VBAT
  Top 0.203: 84.25,12.4 RESET.2 84.25,17.2 84.05,17.4 79.95,17.4 79.85,17.3 79.85,13.7 79.55,13.4 71.75,13.4 | U8.17 84.25,12.4 | 84.25,12.4 84.15,12.5 83.55,12.5 83.45,12.4 U8.19 | PROG.1 68.35,9.62 68.35,13.1 68.65,13.4 71.75,13.4 | 71.75,14.2 71.75,13.4
  Top 0.305: J22.2 39.59,14.44 41.05,15.9 47.05,15.9 48.05,16.9 | 48.05,16.9 48.05,23.14 J19.2 47.89,31.84 49.05,33 51.75,33 52.45,33.7 52.45,36.96 J9.2 | J20.2 62.39,14 | 62.39,14 62.39,14.06 59.45,17 48.15,17 48.05,16.9 | J18.2 71.36,31.89 74.05,29.2 74.05,26.24 J10.2 74.09,16.54 71.75,14.2 62.59,14.2 62.39,14
ADM8641
  Top 0.203: J11.2 46.36,9.64 | 46.36,9.64 J14.2 J16.2 54.15,8.14 54.15,6.9 54.95,6.1 54.95,4.7 54.8,4.55 Q9.S | U4.A1 46.48,9.51 46.36,9.64
  Bottom 0.406: SUPPLY_SELECTOR.6 34.93,35.72 35.55,35.1 35.55,29.1 36.75,27.9 50.35,27.9 51.15,27.1 51.15,14.1 50.35,13.3 45.25,13.3 44.75,12.8 44.75,9.74 J11.2
ADM8641_2
  Top 0.203: J3.2 40.79,36.84 J4.1
  Top 0.406: SUPPLY_SELECTOR.8 29.03,33.18 32.75,36.9 38.09,36.9 J3.2
AP4400
  Bottom 0.406: SUPPLY_SELECTOR.10 30.71,30.64 J15.1
BQ25504  (via drill 0.2 pad 0.25)
  Top 0.203: U7.14 35.95,6.1 v36.1,5.95
  Bottom 0.203: v36.1,5.95 36.1,6.3 35.85,6.55 35.85,10 33.95,11.9 33.95,23.7 29.65,28 25.92,28 SUPPLY_SELECTOR.12
GND  (via drill 0.2 pad 0.25)
  Top 0.203: 83.04,13.74 R21.1 | v82.65,10.5 83.05,10.9 U8.20 | v81.65,9.5 U8.28 | v82.65,6.5 83.05,6.1 U8.41 83.05,5 82.55,4.41 C11.2 | PROG.5 68.4,6.75 66.35,4.7 | Q8.S 53.3,3.05 v53.75,3.5 | Q5.S 67.9,17.25 67.95,17.3 67.95,18.6 v68.05,18.7 | U3.B2 U3.A2 | U4.B2 U4.A2 | U2.A2 U2.B2
  other vias: 78.75,7.3 81.65,10.5 83.65,10.5 84.65,10.5 85.65,10.5 81.65,7.5 82.65,7.5 83.65,7.5 84.65,7.5 85.65,7.5 81.65,8.5 82.65,8.5 83.65,8.5 84.65,8.5 85.65,8.5 82.65,9.5 83.65,9.5 84.65,9.5 85.65,9.5 81.65,6.5 83.65,6.5 84.65,6.5 85.65,6.5 80.55,13.15 50.85,6 47.39,5.34 62.85,36.4 56.35,21.5 64.95,18.8 70.3,16.65 35.05,5 34.9,9.1 44.92,32.8 45.05,34.58 83.09,13.02
  pour Bottom: 0.13,0 0,44.5 88.97,44.45 89.02,4.1 72,4.05 72,-0.05
  pour Top (no thermals): 0.13,0 0,44.5 88.97,44.45 89.02,4.1 72,4.05 72,-0.05
HIGH
  Top 0.203: Q10.D 45.2,22.95 J19.1
LTC1540_E_HYST
  Top 0.203: J2.2 J1.2 55.21,26.3 | 59.65,26.34 J2.2 | J2.2 60.61,26.34 J5.1
  Bottom 0.406: SUPPLY_SELECTOR.4 27.11,38.26 28.35,39.5 53.75,39.5 54.55,38.7 54.55,27.04 J1.2
LTC1540_I_HYST
  Top 0.203: J13.1 62.79,39.14 J12.2 59.27,38.96
  Bottom 0.406: SUPPLY_SELECTOR.2 57.79,40.8 J12.2
N$1
  Top 0.203: SUPPLY_SELECTOR.1 SUPPLY_SELECTOR.3 SUPPLY_SELECTOR.5 SUPPLY_SELECTOR.7 SUPPLY_SELECTOR.9 SUPPLY_SELECTOR.11 | 16.78,7.93 C4.POS C3.POS 20.39,7.87 C2.1 C1.1 21.72,7.83 24.78,7.83
  Top 0.254: SUPPLY_SELECTOR.11 23.24,28.07 21.46,28.07 21.21,27.81 21.21,20.07 21.59,19.68 PV_TO_CAP.3 25.15,19.68 25.65,19.18 25.65,8.7 24.78,7.83
N$2
  Top 0.203: U1.P4 57.33,19.42 57.45,19.3 60.05,19.3 60.15,19.4 60.15,20.03 U1.P5 60.6,20.05 60.65,20.1 60.65,20.5 60.22,20.5 U1.P6
N$3
  Top 0.203: R10.2 61.34,34.05 R9.1 61.85,34.97 61.85,34.5 61.89,34.46 62.19,34.46 | U5.P3 62.19,34.46 | 62.19,34.46 62.15,34.5 62.15,37.2 62.35,37.4 64.08,37.4 R13.2
N$4
  Top 0.203: U5.P6 66.13,34.5 66.55,34.5 66.65,34.4 66.65,34 66.61,33.96 U5.P5 66.05,33.92 66.05,33.2 65.95,33.1 63.25,33.1 63.15,33.2 63.15,33.86 U5.P4
N$5
  Top 0.254: U8.42 83.45,4.5
  Top 0.5: 83.45,4.5 83.45,4.12 C11.1 83.46,2.97 A1.P1
N$7
  Top 0.203: U8.26 L2.1
N$8  (via drill 0.2 pad 0.25)
  Top 0.203: U8.23 81.85,12.2 81.75,12.3 80.55,12.3 80.05,11.8 80.05,11.2 79.85,11 79.45,11 | 79.45,11 78.85,11 | 78.85,11 78.61,10.56 L2.2 78.55,10.24 v78.55,9.4 | C9.1 79.45,11.37 79.45,11 | C10.1 78.85,11.4 78.85,11 | U8.37 81.45,4.9 81.25,4.7 v80.75,4.7
  Bottom 0.203: v80.75,4.7 80.15,4.7 80.05,4.8 80.05,9.1 79.85,9.3 78.65,9.3 v78.55,9.4
N$9  (via drill 0.2 pad 0.25)
  Top 0.203: Q2.G 61.7,16.85 61.45,17.1 v61.45,20.2 | v61.05,21.7 60.32,21.7 U1.P8
  Bottom 0.203: v61.45,20.2 61.45,21.3 v61.05,21.7
N$10
  Top 0.203: U8.34 79.65,7.1 79.55,7.2 79.55,7.8 79.45,7.9 77.85,7.9 77.75,7.8 77.75,6.46 X1.3
N$11
  Top 0.203: U8.35 79.65,6.7 79.55,6.6 79.55,5.3 79.26,5.01 X1.1
N$13
  Top 0.203: J11.1 44.85,5.75 R22.2
N$14
  Top 0.203: R2.2 R1.1 57.32,20.57 U1.P3
N$15
  Top 0.203: Q2.D R4.1 64.08,18.37 64.15,18.3 64.15,17.4 64.25,17.3 64.69,17.3 Q3.G
N$18
  Top 0.203: R1.2 55.35,23.5 J1.1
N$19
  Top 0.203: Q3.S 66,17.25 66.15,17.4 R6.1 66.19,18.5 67.15,18.5 67.25,18.4 Q5.D 67.25,19.5 67.85,20.1 67.85,24.5 68.45,25.1 68.45,26.2 68.35,26.3 67.92,26.3 Q6.G
N$20
  Top 0.203: U1.P7 61.65,21.05 61.75,21.2 61.75,23.65 61.6,23.8 J2.1
N$21
  Top 0.203: J6.1 R4.2
N$22
  Top 0.203: J7.1 R6.2
N$23
  Top 0.203: R7.1 R8.2 68.82,17.4 68.45,17.4 68.45,16.6 68.25,16.5 67.15,16.5 67.04,16.61 Q5.G
N$24  (via drill 0.2 pad 0.25)
  Top 0.203: Q6.D 67.65,25.2 v67.35,24.9 | J10.1 70.05,26.2 69.55,25.7 J8.2
  Bottom 0.203: v67.35,24.9 68.19,24.9 J8.2
N$25
  Top 0.203: J7.2 J6.2 63.39,23.58 J5.2 67.29,26.3 Q6.S
N$26
  Top 0.203: R7.2 69.15,20.8 69.35,21 J8.1
N$27
  Top 0.203: J12.1 61.35,36.6 61.45,36.5 61.45,35.85 R9.2
N$28
  Top 0.203: J13.2 66.85,39.2 67.05,39 67.05,35.2 66.85,35 66.13,35 U5.P7
N$29
  Top 0.203: R11.1 48.65,3.77 Q7.G 48.32,4 47.94,4 47.88,3.94 47.88,3.05 47.75,2.92 U4.C2
N$30
  Top 0.203: Q7.S 48.6,2.85 48.65,2.8 51.15,2.8 51.35,2.9 51.35,3.6 51.45,3.7 52.7,3.7 Q8.D R12.1 53.65,4.47 Q9.G
N$31
  Top 0.203: R14.1 R15.2 56.82,3.5 55.05,3.5 54.1,2.5 52.7,2.5 52.54,2.71 Q8.G
N$32  (via drill 0.2 pad 0.25)
  Top 0.203: J17.2 56.99,9.64 J20.1 | Q9.D v54.15,6
  Bottom 0.203: v54.15,6 54.15,8.14 J17.2
N$33
  Top 0.203: J14.1 R11.2
N$34
  Top 0.203: J16.1 R12.2
N$35
  Top 0.203: R25.2 R24.1 43.74,33.73 U3.C1
N$36
  Top 0.203: J17.1 R14.2
N$37
  Top 0.203: Q10.G 43.87,19.82 43.65,19.6 43.65,18.9 43.45,18.7 U6.6
N$38
  Top 0.203: Q4.D J9.1
N$39  (via drill 0.2)
  Top 0.203: 41.39,31.7 R3.2 | Q1.D 41.34,31.75 R3.2 | U3.B1 43.19,34.16 v43.05,34.29 | v41.28,34.04 41.28,31.81 R3.2
  Bottom 0.203: v43.05,34.29 41.53,34.29 v41.28,34.04
N$40  (via drill 0.2)
  Top 0.203: J3.1 37.77,32.46 37.85,32.38 39.62,32.38 Q1.S 39.69,34.86 40.01,35.18 v41.15,35.18 | v43.05,35.18 43.2,35.18 U3.A1
  Bottom 0.203: v41.15,35.18 v43.05,35.18
N$41  (via drill 0.2)
  Top 0.203: 45.69,33.7 R5.1 | Q4.G 46.57,37.22 46.48,37 46.48,33.8 46.38,33.7 45.92,33.7 R5.1 | 44.35,33.62 U3.C2 45.69,33.66 R5.1 | 40.12,32.5 Q1.G 40.26,32.64 v40.26,33.4 | R5.1 45.72,33.69 45.72,31.24 45.47,30.99 U2.C2 v44.32,29.84
  Bottom 0.203: v40.26,33.4 40.26,29.84 40.51,29.59 44.07,29.59 v44.32,29.84
N$42  (via drill 0.2, 0.2 pad 0.25)
  Top 0.203: J4.2 43.49,35.76 | 43.49,35.76 43.95,35.3 45.12,35.3 v45.5,35.8 45.88,35.42 R5.2 | v47.05,35.8 47.05,36.73 Q4.S | 43.49,35.76 42.36,35.76 42.29,35.69 42.29,34.72 R24.2 | U2.A1 v43.82,32.77
  Bottom 0.203: v45.5,35.8 v47.05,35.8 | v43.82,32.77 43.82,36.68 J4.2
N$43
  Top 0.254: D4.5 10.5,15.2 TP8.TP 13.72,15.24 D4G.2
  Bottom 0.254: D3-4S.2 13.34,24.51 12.32,23.5 12.32,18.92 D4G.2
N$44  (via drill 0.2 pad 0.25)
  Top 0.203: L1.1 31.05,7.15 U7.5 32.18,8.22 v32.25,8.3 | v35.25,8.1 35.25,7.28 U7.16
  Bottom 0.203: v32.25,8.3 35.05,8.3 v35.25,8.1
N$46
  Top 0.203: U7.7 30.67,6.15 R18.2 R16.2
N$47
  Top 0.203: U7.11 33.9,4.15 34.05,4 35.45,4 35.65,4.2 35.65,4.4 39.55,4.4 39.75,4.6 39.75,6.6 39.65,6.7 39.12,6.7 Q11.G
N$49
  Top 0.203: R18.1 R19.2 30.73,4.33 30.85,4.45 32.75,4.45 32.85,4.5 32.85,4.88 U7.9
N$50
  Top 0.203: R19.1 31.49,3.47 R20.2 31.52,3.87 31.65,4 33.35,4 33.45,4.1 33.45,4.88 U7.10
N$51
  Top 0.203: U7.4 32.9,9.13 C6.1
N$52
  Top 0.203: U8.30 75.1,8.75 74.65,9.2 74.65,11.2 73.35,12.5 70.85,12.5 70.35,12 70.35,9.69 PROG.2
N$53
  Top 0.203: U8.31 74.7,8.35 74.25,8.8 70.74,8.8 PROG.4
N$54
  Top 0.203: R16.1 R17.2 28.22,4.33 28.15,4.4 28.15,6.4 28.35,6.7 32.13,6.7 U7.6
N$56
  Top 0.203: RESET.1 82.12,14.33 R21.2 82.12,12.93 82.65,12.4 U8.21
N$59
  Top 0.203: R22.1 R23.2 45.8,3.61 45.97,3.43 45.97,2.92 U4.C1
N$60
  Top 0.203: R25.1 R26.2 42.87,31.29 43.18,30.99 U2.C1
N$61
  Top 0.254: D1.5 10.48,37.22 TP6.TP 12.87,37.3 D1G.2
N$62
  Top 0.254: D2.5 10.47,30.54 TP2.TP 11.56,30.61 D2G.2
  Bottom 0.254: D1-2S.2 13.21,40.77 12.07,39.62 12.07,30.1 D2G.2
N$63
  Top 0.254: D3.5 10.47,23.3 TP7.TP 10.67,23.37 D3G.2
  Bottom 0.254: D2-3S.2 15.62,32.64 16.13,32.13 16.13,20.45 D3G.2
N$65
  Top 0.254: D1PV.2 D1-2S.1 11.91,40.92 TP3.TP 10.44,41.03 D1.8
N$66
  Top 0.254: D1PV.1 19.18,40.77 19.68,40.26 19.68,32.51 | 19.68,32.51 19.68,24.26 | 19.68,24.26 19.68,17.53 | D2PV.1 19.56,32.64 19.68,32.51 | D3PV.1 19.43,24.51 19.68,24.26 | D4.8 10.46,19.01 TP5.TP 12.95,18.92 14.1,17.78 19.43,17.78 19.68,17.53 | 23.11,17.02 PV_TO_CAP.2 22.86,17.53 19.68,17.53
N$67
  Top 0.254: D2PV.2 D2-3S.1 10.54,34.29 TP4.TP 10.44,34.35 D2.8
N$68
  Top 0.254: D3PV.2 D3-4S.1 10.54,26.16 TP1.TP 10.48,27.11 D3.8
OUT  (via drill 0.2 pad 0.25)
  Top 0.203: U5.P8 66.41,35.46 66.55,35.6 66.55,37.2 66.35,37.4 v66.15,37.4 65.05,37.4 R13.1
  Bottom 0.203: v66.15,37.4 68.35,37.4 68.75,37.8 68.75,39.07 J18.1
OUT2  (via drill 0.2 pad 0.25)
  Top 0.203: Q11.D 38.85,5.2 v38.75,5.05
  Bottom 0.203: v38.75,5.05 38.75,9.4 J22.1
PV
  Top 0.203: C5.1 30.83,8.63 L1.2 30.85,10.6 29.63,11.82 J21.1 29.53,11.8
  Bottom 0.254: PV_TO_CAP.1 23.24,13.46 25.02,11.68 29.39,11.68 J21.1
VDD  (via drill 0.2 pad 0.25)
  Top 0.203: J15.2 42.45,23.2 42.85,22.8 42.85,20.77 U6.10 v44.05,20.7 | Q10.S 44.5,18.75 v44.55,18.7
  Bottom 0.203: v44.55,18.7 44.55,20.2 v44.05,20.7
VIN_DC  (via drill 0.2 pad 0.25)
  Top 0.203: U7.2 33.9,8.75 v34.05,8.95
  Bottom 0.203: v34.05,8.95 34.05,9.81 33.95,9.94 J21.2
VSTOR
  Top 0.203: 35.95,6.65 U7.15 35.14,6.63 C7.1 C8.1 | 35.95,6.65 Q11.S | U7.3 33.4,10.05 33.45,10.1 35.85,10.1 35.95,10 35.95,6.65

### Text on the board
tDocu: ADM8641_2 | LTC1540_1 | LTC1540_1 | LTC1540_2 | ADM8641_1 | Cinamin Beacon / Evaluation Board / Rev_A / Joshua Adkins / 08/2015 | ADM8641_2 | AP4400 | LTC1540_2 | BQ25504 | AP4400 | Bluetooth | CAP | BQ25504 | BQ | ADM8641_1 | Buffer Caps